# EAGLE design MiataPopUpEnhancer (EAGLE 9.6.0)
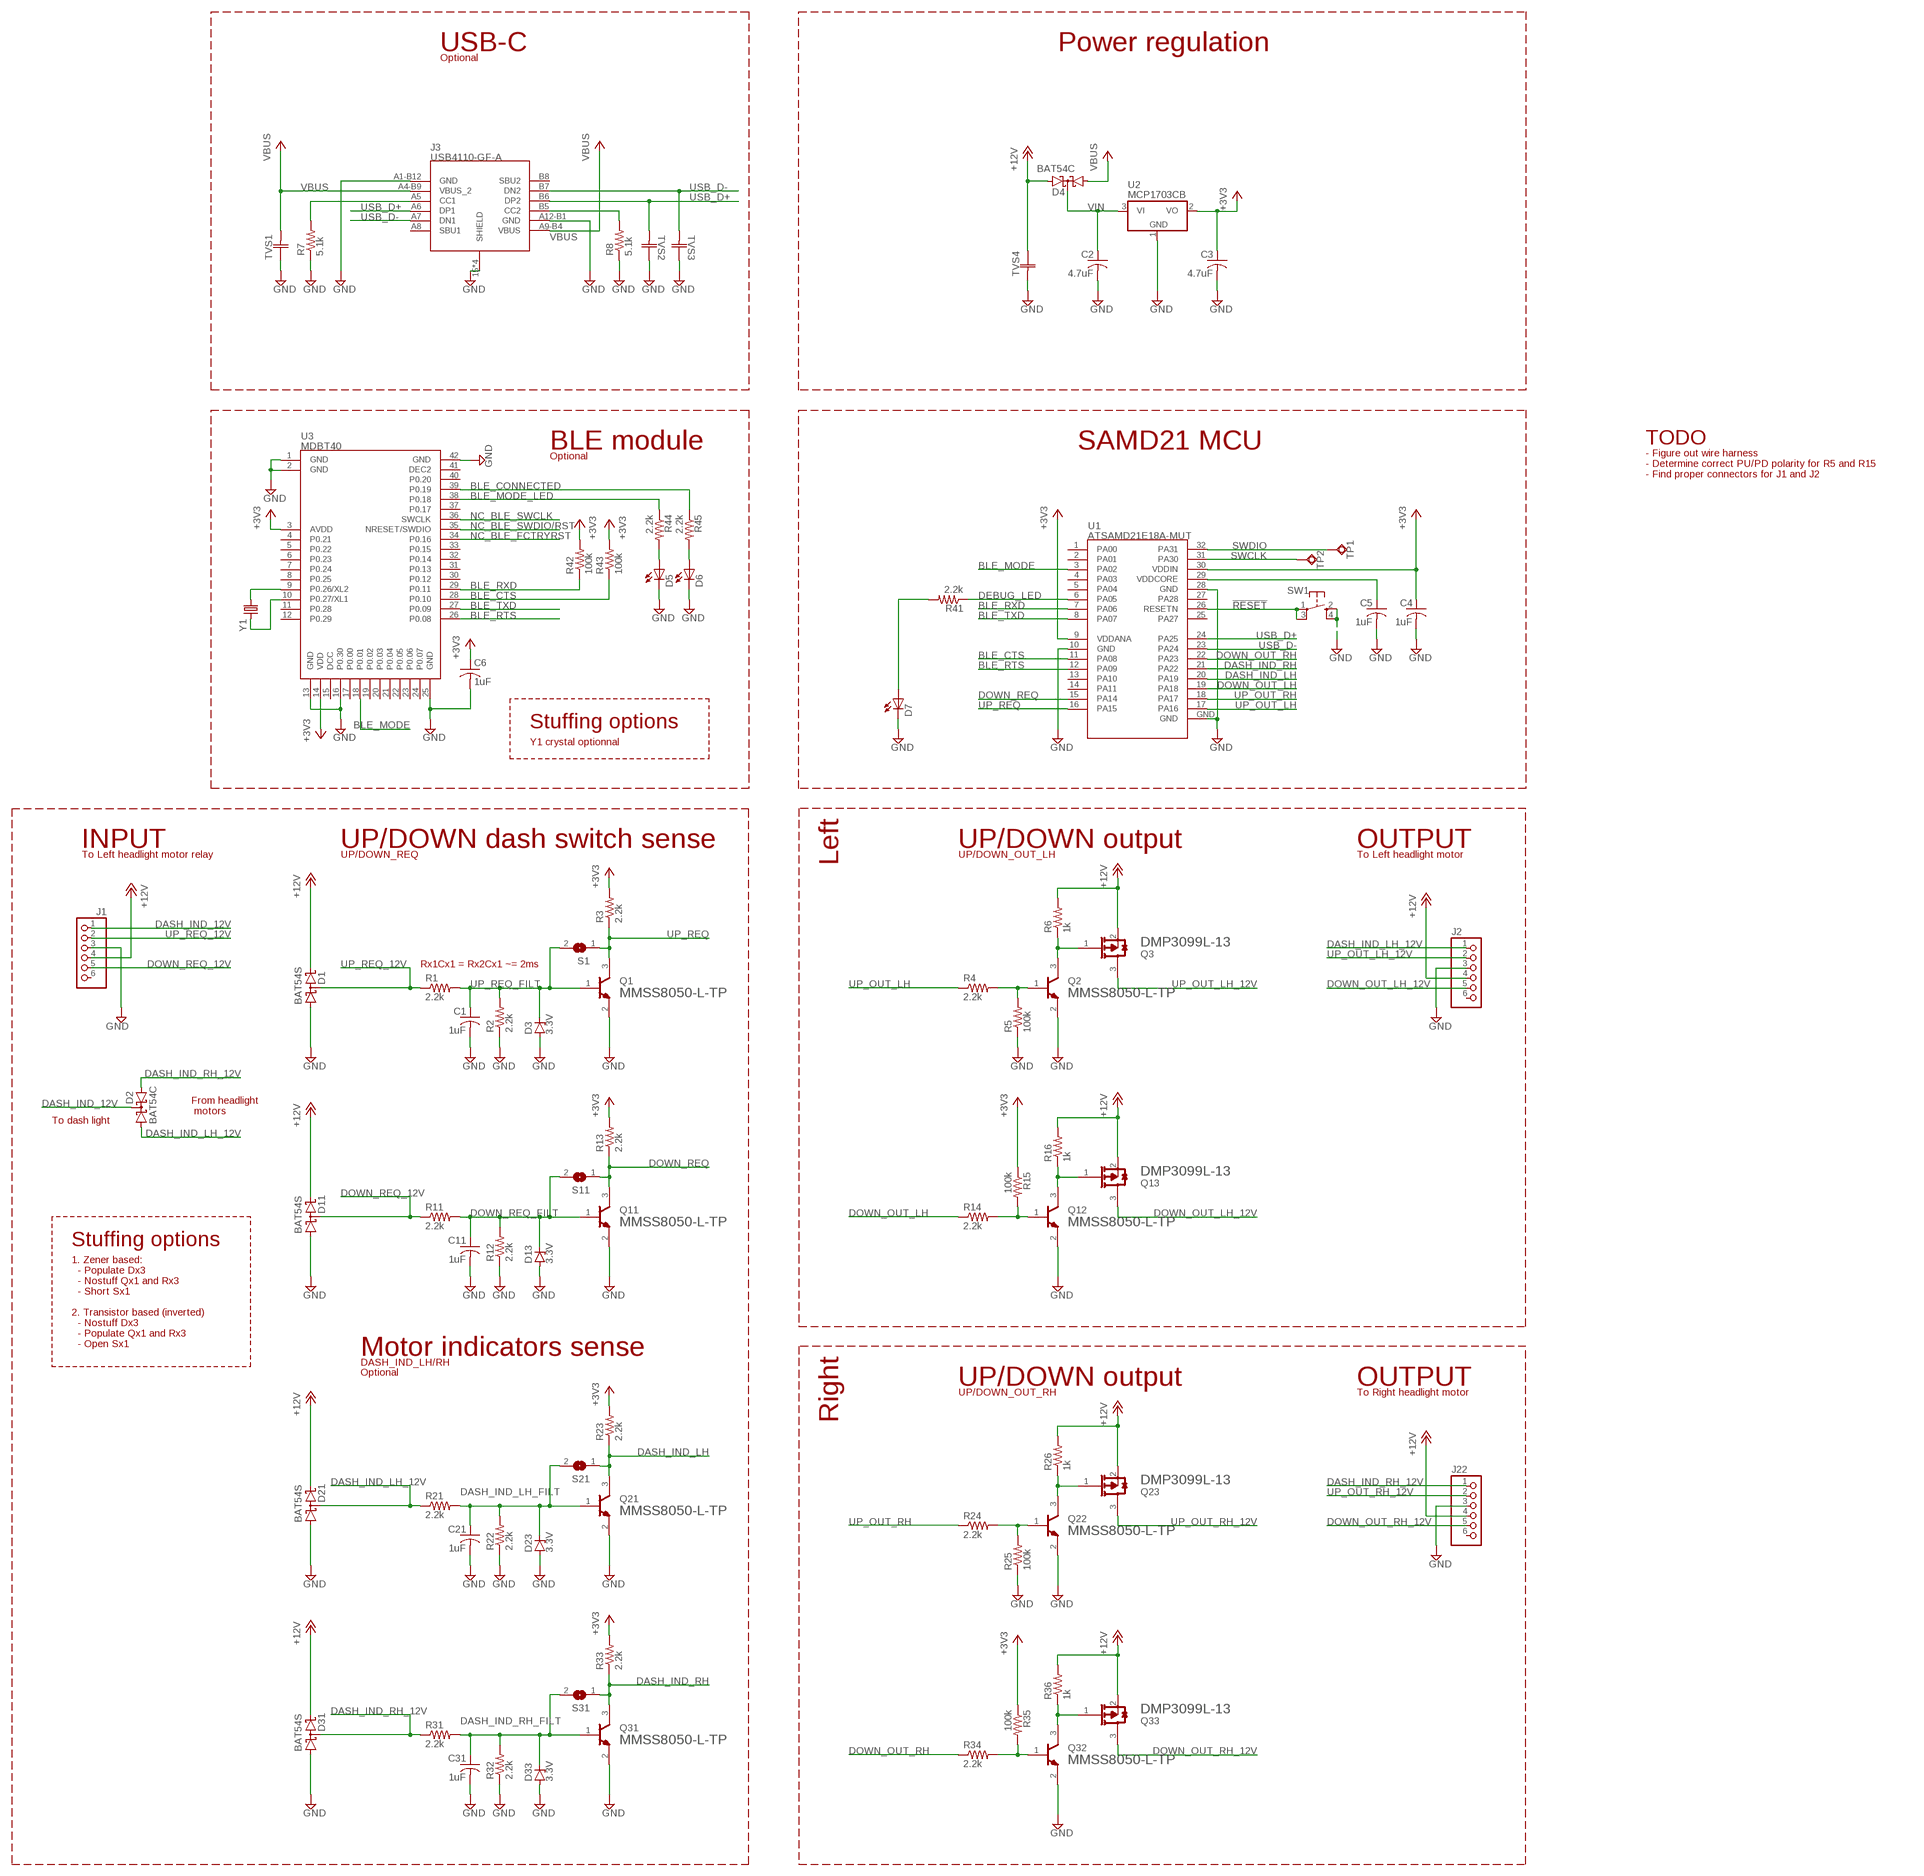
[diagram p0: schematic, sheet 1]

## Parts
C1  1uF  C-USC0603  [C0603]
C2  4.7uF  C-USC0603K  [C0603K]
C3  4.7uF  C-USC0603  [C0603]
C4  1uF  C-USC0603  [C0603]
C5  1uF  C-USC0603  [C0603]
C6  1uF  C-USC0603  [C0603]
C11  1uF  C-USC0603  [C0603]
C21  1uF  C-USC0603  [C0603]
C31  1uF  C-USC0603  [C0603]
D1  BAT54S  [SOT23]
D2  BAT54C  [SOT23]
D3  3.3V  BZX84CSMD  [TO236]
D4  BAT54C  [SOT23]
D5  LEDCHIPLED_0603  [CHIPLED_0603]
D6  LEDCHIPLED_0603  [CHIPLED_0603]
D7  LEDCHIPLED_0603  [CHIPLED_0603]
D11  BAT54S  [SOT23]
D13  3.3V  BZX84CSMD  [TO236]
D21  BAT54S  [SOT23]
D23  3.3V  BZX84CSMD  [TO236]
D31  BAT54S  [SOT23]
D33  3.3V  BZX84CSMD  [TO236]
J1  PINHD-1X6LOCK  [1X06-BIGLOCK]
J2  PINHD-1X6LOCK  [1X06-BIGLOCK]
J3  USB4110-GF-A  [USB4110-GF-A_GCT]
J22  PINHD-1X6LOCK  [1X06-BIGLOCK]
Q1  MICRO_COMMERCIAL_MMSS8050-L-TPMICRO_COMMERCIAL_MMSS8050-L-TP_0_0  [MICRO_COMMERCIAL_MMSS8050-L-TP_0]
Q2  MICRO_COMMERCIAL_MMSS8050-L-TPMICRO_COMMERCIAL_MMSS8050-L-TP_0_0  [MICRO_COMMERCIAL_MMSS8050-L-TP_0]
Q3  DIODES_INC_DMP3099L-13DIODES_INC_DMP3099L-13_0_0  [DIODES_INC_DMP3099L-13_0]
Q11  MICRO_COMMERCIAL_MMSS8050-L-TPMICRO_COMMERCIAL_MMSS8050-L-TP_0_0  [MICRO_COMMERCIAL_MMSS8050-L-TP_0]
Q12  MICRO_COMMERCIAL_MMSS8050-L-TPMICRO_COMMERCIAL_MMSS8050-L-TP_0_0  [MICRO_COMMERCIAL_MMSS8050-L-TP_0]
Q13  DIODES_INC_DMP3099L-13DIODES_INC_DMP3099L-13_0_0  [DIODES_INC_DMP3099L-13_0]
Q21  MICRO_COMMERCIAL_MMSS8050-L-TPMICRO_COMMERCIAL_MMSS8050-L-TP_0_0  [MICRO_COMMERCIAL_MMSS8050-L-TP_0]
Q22  MICRO_COMMERCIAL_MMSS8050-L-TPMICRO_COMMERCIAL_MMSS8050-L-TP_0_0  [MICRO_COMMERCIAL_MMSS8050-L-TP_0]
Q23  DIODES_INC_DMP3099L-13DIODES_INC_DMP3099L-13_0_0  [DIODES_INC_DMP3099L-13_0]
Q31  MICRO_COMMERCIAL_MMSS8050-L-TPMICRO_COMMERCIAL_MMSS8050-L-TP_0_0  [MICRO_COMMERCIAL_MMSS8050-L-TP_0]
Q32  MICRO_COMMERCIAL_MMSS8050-L-TPMICRO_COMMERCIAL_MMSS8050-L-TP_0_0  [MICRO_COMMERCIAL_MMSS8050-L-TP_0]
Q33  DIODES_INC_DMP3099L-13DIODES_INC_DMP3099L-13_0_0  [DIODES_INC_DMP3099L-13_0]
R1  2.2k  R-US_R0603  [R0603]
R2  2.2k  R-US_R0603  [R0603]
R3  2.2k  R-US_R0603  [R0603]
R4  2.2k  R-US_R0603  [R0603]
R5  100k  R-US_R0603  [R0603]
R6  1k  R-US_R0603  [R0603]
R7  5.1k  R-US_R0603  [R0603]
R8  5.1k  R-US_R0603  [R0603]
R11  2.2k  R-US_R0603  [R0603]
R12  2.2k  R-US_R0603  [R0603]
R13  2.2k  R-US_R0603  [R0603]
R14  2.2k  R-US_R0603  [R0603]
R15  100k  R-US_R0603  [R0603]
R16  1k  R-US_R0603  [R0603]
R21  2.2k  R-US_R0603  [R0603]
R22  2.2k  R-US_R0603  [R0603]
R23  2.2k  R-US_R0603  [R0603]
R24  2.2k  R-US_R0603  [R0603]
R25  100k  R-US_R0603  [R0603]
R26  1k  R-US_R0603  [R0603]
R31  2.2k  R-US_R0603  [R0603]
R32  2.2k  R-US_R0603  [R0603]
R33  2.2k  R-US_R0603  [R0603]
R34  2.2k  R-US_R0603  [R0603]
R35  100k  R-US_R0603  [R0603]
R36  1k  R-US_R0603  [R0603]
R41  2.2k  R-US_R0603  [R0603]
R42  100k  R-US_R0603  [R0603]
R43  100k  R-US_R0603  [R0603]
R44  2.2k  R-US_R0603  [R0603]
R45  2.2k  R-US_R0603  [R0603]
S1  SJ  [SJ]
S11  SJ  [SJ]
S21  SJ  [SJ]
S31  SJ  [SJ]
SW1  KMR2  SPST_TACT-KMR2  [KMR2]
TP1  TPSQB2,54  [B2,54]
TP2  TPSQB2,54  [B2,54]
TVS1  ESDU02A5V5R17V  [CAP_ESDU02_STP]
TVS2  ESDU02A5V5R17V  [CAP_ESDU02_STP]
TVS3  ESDU02A5V5R17V  [CAP_ESDU02_STP]
TVS4  ESDU02A5V5R17V  [CAP_ESDU02_STP]
U1  ATSAMD21E18A-MUT  [QFN32]
U2  MCP1703CB  [SOT23]
U3  MDBT40  [MDBT40]
Y1  ABS25-32.768KHZ-T  CRYSTALMM20SS  [MM20SS]

## Nets
!RESET: SW1.1(P) SW1.3(P1) U1.26(RESETN)
+3V3: C3.1 C4.1 C6.1 R3.2 R13.2 R15.1 R23.2 R33.2 R35.1 R42.2 R43.2 U1.9(VDDANA) U1.30(VDDIN) U2.2(VO) U3.3(AVDD) U3.14(VDD)
+12V: D1.2(C2) D4.2(A2) D11.2(C2) D21.2(C2) D31.2(C2) J1.4 J2.4 J22.4 Q3.2(S) Q13.2(S) Q23.2(S) Q33.2(S) R6.2 R16.2 R26.2 R36.2 TVS4.1
BLE_CONNECTED: R45.1 U3.39(P0.19)
BLE_CTS: R43.1 U1.11(PA08) U3.28(P0.10)
BLE_MODE: U1.3(PA02) U3.18(P0.01)
BLE_MODE_LED: R44.1 U3.38(P0.18)
BLE_RTS: U1.12(PA09) U3.26(P0.08)
BLE_RXD: R42.1 U1.7(PA06) U3.29(P0.11)
BLE_TXD: U1.8(PA07) U3.27(P0.09)
CC1: J3.A5(CC1) R7.2
CC2: J3.B5(CC2) R8.2
DASH_IND_12V: D2.3(CC) J1.1
DASH_IND_LH: Q21.3(C) R23.1 S21.1 U1.20(PA19)
DASH_IND_LH_12V: D2.1(A1) D21.3(C1A2) J2.1 R21.1
DASH_IND_LH_FILT: C21.1 D23.C Q21.1(B) R21.2 R22.2 S21.2
DASH_IND_RH: Q31.3(C) R33.1 S31.1 U1.21(PA22)
DASH_IND_RH_12V: D2.2(A2) D31.3(C1A2) J22.1 R31.1
DASH_IND_RH_FILT: C31.1 D33.C Q31.1(B) R31.2 R32.2 S31.2
DEBUG_LED: R41.1 U1.6(PA05)
DOWN_OUT_LH: R14.1 U1.19(PA18)
DOWN_OUT_LH_12V: J2.5 Q13.3(D)
DOWN_OUT_RH: R34.1 U1.22(PA23)
DOWN_OUT_RH_12V: J22.5 Q33.3(D)
DOWN_REQ: Q11.3(C) R13.1 S11.1 U1.15(PA14)
DOWN_REQ_12V: D11.3(C1A2) J1.5 R11.1
DOWN_REQ_FILT: C11.1 D13.C Q11.1(B) R11.2 R12.2 S11.2
GND: C1.2 C2.2 C3.2 C4.2 C5.2 C6.2 C11.2 C21.2 C31.2 D1.1(A1) D3.A D5.C D6.C D7.C D11.1(A1) D13.A D21.1(A1) D23.A D31.1(A1) D33.A J1.3 J2.3 J3.15(SHIELD) J3.16(SHIELD) J3.17(SHIELD) J3.18(SHIELD) J3.A1-B12(GND) J3.A12-B1(GND) J22.3 Q1.2(E) Q2.2(E) Q11.2(E) Q12.2(E) Q21.2(E) Q22.2(E) Q31.2(E) Q32.2(E) R2.1 R5.1 R7.1 R8.1 R12.1 R22.1 R25.1 R32.1 SW1.2(S) SW1.4(S1) TVS1.1 TVS2.1 TVS3.1 TVS4.2 U1.10(GND) U1.28(GND) U1.GND U2.1(GND) U3.1(GND) U3.2(GND) U3.13(GND) U3.16(P0.30) U3.25(GND) U3.42(GND)
N$1: Q12.3(C) Q13.1(G) R16.1
N$2: Q2.3(C) Q3.1(G) R6.1
N$4: Q12.1(B) R14.2 R15.2
N$5: Q2.1(B) R4.2 R5.2
N$7: Q22.3(C) Q23.1(G) R26.1
N$8: Q22.1(B) R24.2 R25.2
N$10: Q32.3(C) Q33.1(G) R36.1
N$11: Q32.1(B) R34.2 R35.2
N$14: D5.A R44.2
N$15: D6.A R45.2
N$16: D7.A R41.2
NC_BLE_FCTRYRST: U3.34(P0.16)
NC_BLE_SWCLK: U3.36(SWCLK)
NC_BLE_SWDIO/RST: U3.35(NRESET/SWDIO)
SWCLK: TP2.TP U1.31(PA30)
SWDIO: TP1.TP U1.32(PA31)
UP_OUT_LH: R4.1 U1.17(PA16)
UP_OUT_LH_12V: J2.2 Q3.3(D)
UP_OUT_RH: R24.1 U1.18(PA17)
UP_OUT_RH_12V: J22.2 Q23.3(D)
UP_REQ: Q1.3(C) R3.1 S1.1 U1.16(PA15)
UP_REQ_12V: D1.3(C1A2) J1.2 R1.1
UP_REQ_FILT: C1.1 D3.C Q1.1(B) R1.2 R2.2 S1.2
USB_D+: J3.A6(DP1) J3.B6(DP2) TVS2.2 U1.24(PA25)
USB_D-: J3.A7(DN1) J3.B7(DN2) TVS3.2 U1.23(PA24)
VBUS: D4.1(A1) J3.A4-B9(VBUS_2) J3.A9-B4(VBUS) TVS1.2
VDDCORE: C5.1 U1.29(VDDCORE)
VIN: C2.1 D4.3(CC) U2.3(VI)
XL1: U3.10(P0.27/XL1) Y1.4
XL2: U3.9(P0.26/XL2) Y1.1
Unconnected: J1.6 J2.6 J3.A8(SBU1) J3.B8(SBU2) J22.6 U1.1(PA00) U1.2(PA01) U1.4(PA03) U1.5(PA04) U1.13(PA10) U1.14(PA11) U1.25(PA27) U1.27(PA28) U3.4(P0.21) U3.5(P0.22) U3.6(P0.23) U3.7(P0.24) U3.8(P0.25) U3.11(P0.28) U3.12(P0.29) U3.15(DCC) U3.17(P0.00) U3.19(P0.02) U3.20(P0.03) U3.21(P0.04) U3.22(P0.05) U3.23(P0.06) U3.24(P0.07) U3.30(P0.12) U3.31(P0.13) U3.32(P0.14) U3.33(P0.15) U3.37(P0.17) U3.40(P0.20) U3.41(DEC2)

## Notes on the sheet
- USB-C | Power regulation
- Optional
- TODO
- BLE module | SAMD21 MCU
- - Figure out wire harness
  - Determine correct PU/PD polarity for R5 and R15
  - Find proper connectors for J1 and J2
- Optional
- Stuffing options
- Y1 crystal optionnal
- Left
- INPUT | UP/DOWN dash switch sense | UP/DOWN output | OUTPUT
- To Left headlight motor relay | UP/DOWN_REQ | UP/DOWN_OUT_LH | To Left headlight motor
- Rx1Cx1 = Rx2Cx1 ~= 2ms
- From headlight
   motors
- To dash light
- Stuffing options
- 1. Zener based:
    - Populate Dx3
    - Nostuff Qx1 and Rx3
    - Short Sx1
  
  2. Transistor based (inverted)
    - Nostuff Dx3
    - Populate Qx1 and Rx3
    - Open Sx1
- Motor indicators sense | Right
- DASH_IND_LH/RH
- Optional
- UP/DOWN output | OUTPUT
- UP/DOWN_OUT_RH | To Right headlight motor

## Library data of the parts
C1-C6 C11 C21 C31 = adafruit:C-US: CAPACITOR, American symbol
D1 D11 D21 D31 = diode:BAT54S: Schottky Diodes Pin connection corrected 2011-05-04 Source: Fairchild .. BAT54.pdf
D2 D4 = diode:BAT54C: Schottky Diodes Source: Fairchild .. BAT54.pdf
D3 D13 D23 D33 = diode:BZX84CSMD: Z DIODE
D5-D7 = adafruit:LED: LED OSRAM: - CHIPLED LG R971, LG N971, LY N971, LG Q971, LY Q971, LO R971, LY R971 LH N974, LH R974 LS Q976, LO Q976, LY Q976 LO Q996 - Hyper CHIPLED LW Q18S LB Q993, LB Q99A, LB R99A - SideLED LS A670, LO A670, LY A670, LG A670, LP A670 LB A673, LV A673, LT A673, LW A673 LH A674 LY A675 LS A676, LA A676, LO A676, LY A676, LW A676 LS A679, LY A679, LG A679 - Hyper Micro SIDELED® LS Y876, LA Y876, LO Y876, LY Y876 LT Y87S - SmartLED LW L88C, LW L88S LB L89C, LB L89S, LG L890 LS L89K, LO L89K, LY L89K LS L896, LA L896, LO L896, LY L896 - TOPLED LS T670, LO T670, LY T670, LG T670, LP T670 LSG T670, LSP T670, LSY T670, LOP T670, LYG T670 LG T671, LOG T671, LSG T671 LB T673, LV T673, LT T673, LW T673 LH T674 LS T676, LA T676, LO T676, LY T676, LB T676, LH T676, LSB T676, LW T676 LB T67C, LV T67C, LT T67C, LS T67K, LO T67K, LY T67K, LW E67C LS E67B, LA E67B, LO E67B, LY E67B, LB E67C, LV E67C, LT E67C LW T67C LS T679, LY T679, LG T679 LS T770, LO T770, LY T770, LG T770, LP T770 LB T773, LV T773, LT T773, LW T773 LH T774 LS E675, LA E675, LY E675, LS T675 LS T776, LA T776, LO T776, LY T776, LB T776 LHGB T686 LT T68C, LB T68C - Hyper Mini TOPLED® LB M676 - Mini TOPLED Santana® LG M470 LS M47K, LO M47K, LY M47K Source: http://www.osram.convergy.de/
J1 J2 J22 = adafruit:PINHD-1X6: PIN HEADER
J3 = USB4110-GF-A:USB4110-GF-A; COPYRIGHT: Copyright (C) 2021 Ultra Librarian. All rights reserved.; DIGI-KEY_PART_NUMBER_1: 2073-USB4110-GF-A-1-ND; DIGI-KEY_PART_NUMBER_2: 2073-USB4110-GF-A-2-ND; DIGI-KEY_PART_NUMBER_3: 2073-USB4110-GF-A-6-ND; MANUFACTURER_PART_NUMBER: USB4110-GF-A; MFR_NAME: Global Connector Technology
Q1 Q2 Q11 Q12 Q21 Q22 Q31 Q32 = Micro Commercial - MMSS8050-L-TP - Copy:MICRO_COMMERCIAL_MMSS8050-L-TP: MMSS8050-L-TP; CENTROID_NOT_SPECIFIED: No; DATASHEET: http://www.mccsemi.com/up_pdf/MMSS8050(SOT-23).pdf; DIGIKEY_DESCRIPTION: TRANS Bipolar (BJT) Transistor NPN 25V 1.5A 100MHz 625mW Surface Mount SOT-23; DIGIKEY_PART_NUMBER: MMSS8050-L-TPMSCT-ND; IPC_LAND_PATTERN_NAME: SOT96P237X100-3; LEAD_FREE: yes; MF: Micro Commercial; MOUSER_PART_NUMBER: 833-MMSS8050-L-TP; MPN: MMSS8050-L-TP; PACKAGE: SOT23-3; PREFIX: Q; ROHS: yes; TEMPERATURE_RANGE_HIGH: +150°C; TEMPERATURE_RANGE_LOW: -55°C
Q3 Q13 Q23 Q33 = Diodes Inc. - DMP3099L-13:DIODES_INC_DMP3099L-13: P-Channel 30V 3.8A (Ta) 1.08W (Ta) Surface Mount SOT-23; AUTOMOTIVE: Yes; AUTOMOTIVE_GRADE: Grade 0; CENTROID_NOT_SPECIFIED: No; CONTINUOUS_DRAIN_CURRENT: -3.8A; DATASHEET: https://www.diodes.com/assets/Datasheets/DMP3099L.pdf; DEPLETION_MODE: False; DEVICE_CLASS_L1: Discrete Semiconductors; DEVICE_CLASS_L2: Transistors; DEVICE_CLASS_L3: MOSFETs; DIGIKEY_DESCRIPTION: MOSFET P-CH 30V 3.8A SOT23; DIGIKEY_PART_NUMBER: DMP3099L-13DICT-ND; DRAIN_TO_SOURCE_BREAKDOWN_VOLTAGE: -30V; DRAIN_TO_SOURCE_RESISTANCE: 65mΩ; DRAIN_TO_SOURCE_VOLTAGE: -30V; FOOTPRINT_PARAMETERS_1: {"fp_type":"SOT23","params":{"N":{"default":"3","long name":"Number of leads","type":"multichoice","short name":"N"},"A":{"nom":1024999,"long name":"Height","min":903000,"max":1100000,"short name":"A","type":"measurement"},"A1":{"nom":50000,"long name":"Package clearance","min":13000,"max":100000,"short name":"A1","type":"measurement"},"A2":{"nom":975000,"long name":"Package height","min":890000,"max":1000000,"short name":"A2","type":"measurement"},"D":{"nom":2900000,"long name":"Package length","min":2800000,"max":3000000,"short name":"D","type":"measurement"},"E":{"nom":2400000,"long name":"Width /w leads","min":2300000,"max":2500000,"short name":"E","type":"measurement"},"E1":{"nom":1300000,"long name":"Package width","min":1200000,"max":1400000,"short name":"E1","type":"measurement"},"B":{"nom":400000,"long name":"Lead width","min":370000,"max":510000,"short name":"B","type":"measurement"},"C":{"nom":110000,"long name":"Lead thickness","min":85000,"max":150000,"short name":"C","type":"measurement"},"L":{"nom":400000,"long name":"Lead foot length","min":250000,"max":550000,"short name":"L","type":"measurement"},"e":{"nom":915000,"long name":"Lead pitch","min":null,"max":null,"short name":"e","type":"measurement"},"PHI":{"nom":false,"long name":"Lead angle","min":0,"max":8,"short name":"PHI","type":"measurement"},"offset x":{"nom":0,"long name":"X Center offset","min":null,"max":null,"short name":"offset x","type":"measurement"},"offset y":{"nom":0,"long name":"Y Center offset","min":null,"max":null,"short name":"offset y","type":"measurement"},"LS":{"default":"Rounded rectangle","long name":"Land shape","type":"multichoice","short name":"LS"},"LS1":{"default":"Rectangle","long name":"Land shape (Pin 1)","type":"multichoice","short name":"LS1"},"solder toe":{"nom":550000,"long name":"Solder fillet (toe)","min":null,"max":null,"short name":"solder toe","type":"fixedmeasurement"},"solder heel":{"nom":450000,"long name":"Solder fillet (heel)","min":null,"max":null,"short name":"solder heel","type":"fixedmeasurement"},"solder side":{"nom":50000,"long name":"Solder fillet (side)","min":null,"max":null,"short name":"solder side","type":"fixedmeasurement"},"courtyard":{"nom":500000,"long name":"Courtyard","min":null,"max":null,"short name":"courtyard","type":"fixedmeasurement"},"SF":{"default":"A","long name":"Packing level","type":"multichoiceparent","short name":"SF","help":"http://support.upverter.com/customer/portal/articles/978783-what-is-a-footprint-packing-level","children":["solder toe","solder heel","solder side","courtyard"]}}}; FOOTPRINT_PARAMETERS_2: {"fp_type":"SOT23","params":{"N":{"default":"3","long name":"Number of leads","type":"multichoice","short name":"N"},"A":{"nom":1024999,"long name":"Height","min":903000,"max":1100000,"short name":"A","type":"measurement"},"A1":{"nom":50000,"long name":"Package clearance","min":13000,"max":100000,"short name":"A1","type":"measurement"},"A2":{"nom":975000,"long name":"Package height","min":890000,"max":1000000,"short name":"A2","type":"measurement"},"D":{"nom":2900000,"long name":"Package length","min":2800000,"max":3000000,"short name":"D","type":"measurement"},"E":{"nom":2400000,"long name":"Width /w leads","min":2300000,"max":2500000,"short name":"E","type":"measurement"},"E1":{"nom":1300000,"long name":"Package width","min":1200000,"max":1400000,"short name":"E1","type":"measurement"},"B":{"nom":400000,"long name":"Lead width","min":370000,"max":510000,"short name":"B","type":"measurement"},"C":{"nom":110000,"long name":"Lead thickness","min":85000,"max":150000,"short name":"C","type":"measurement"},"L":{"nom":400000,"long name":"Lead foot length","min":250000,"max":550000,"short name":"L","type":"measurement"},"e":{"nom":915000,"long name":"Lead pitch","min":null,"max":null,"short name":"e","type":"measurement"},"PHI":{"nom":false,"long name":"Lead angle","min":0,"max":8,"short name":"PHI","type":"measurement"},"offset x":{"nom":0,"long name":"X Center offset","min":null,"max":null,"short name":"offset x","type":"measurement"},"offset y":{"nom":0,"long name":"Y Center offset","min":null,"max":null,"short name":"offset y","type":"measurement"},"LS":{"default":"Rounded rectangle","long name":"Land shape","type":"multichoice","short name":"LS"},"LS1":{"default":"Rectangle","long name":"Land shape (Pin 1)","type":"multichoice","short name":"LS1"},"solder toe":{"nom":350000,"long name":"Solder fillet (toe)","min":null,"max":null,"short name":"solder toe","type":"fixedmeasurement"},"solder heel":{"nom":350000,"long name":"Solder fillet (heel)","min":null,"max":null,"short name":"solder heel","type":"fixedmeasurement"},"solder side":{"nom":30000,"long name":"Solder fillet (side)","min":null,"max":null,"short name":"solder side","type":"fixedmeasurement"},"courtyard":{"nom":250000,"long name":"Courtyard","min":null,"max":null,"short name":"courtyard","type":"fixedmeasurement"},"SF":{"default":"B","long name":"Packing level","type":"multichoiceparent","short name":"SF","help":"http://support.upverter.com/customer/portal/articles/978783-what-is-a-footprint-packing-level","children":["solder toe","solder heel","solder side","courtyard"]}}}; FOOTPRINT_PARAMETERS_3: {"fp_type":"SOT23","params":{"N":{"default":"3","long name":"Number of leads","type":"multichoice","short name":"N"},"A":{"nom":1024999,"long name":"Height","min":903000,"max":1100000,"short name":"A","type":"measurement"},"A1":{"nom":50000,"long name":"Package clearance","min":13000,"max":100000,"short name":"A1","type":"measurement"},"A2":{"nom":975000,"long name":"Package height","min":890000,"max":1000000,"short name":"A2","type":"measurement"},"D":{"nom":2900000,"long name":"Package length","min":2800000,"max":3000000,"short name":"D","type":"measurement"},"E":{"nom":2400000,"long name":"Width /w leads","min":2300000,"max":2500000,"short name":"E","type":"measurement"},"E1":{"nom":1300000,"long name":"Package width","min":1200000,"max":1400000,"short name":"E1","type":"measurement"},"B":{"nom":400000,"long name":"Lead width","min":370000,"max":510000,"short name":"B","type":"measurement"},"C":{"nom":110000,"long name":"Lead thickness","min":85000,"max":150000,"short name":"C","type":"measurement"},"L":{"nom":400000,"long name":"Lead foot length","min":250000,"max":550000,"short name":"L","type":"measurement"},"e":{"nom":915000,"long name":"Lead pitch","min":null,"max":null,"short name":"e","type":"measurement"},"PHI":{"nom":false,"long name":"Lead angle","min":0,"max":8,"short name":"PHI","type":"measurement"},"offset x":{"nom":0,"long name":"X Center offset","min":null,"max":null,"short name":"offset x","type":"measurement"},"offset y":{"nom":0,"long name":"Y Center offset","min":null,"max":null,"short name":"offset y","type":"measurement"},"LS":{"default":"Rounded rectangle","long name":"Land shape","type":"multichoice","short name":"LS"},"LS1":{"default":"Rectangle","long name":"Land shape (Pin 1)","type":"multichoice","short name":"LS1"},"solder toe":{"nom":150000,"long name":"Solder fillet (toe)","min":null,"max":null,"short name":"solder toe","type":"fixedmeasurement"},"solder heel":{"nom":250000,"long name":"Solder fillet (heel)","min":null,"max":null,"short name":"solder heel","type":"fixedmeasurement"},"solder side":{"nom":10000,"long name":"Solder fillet (side)","min":null,"max":null,"short name":"solder side","type":"fixedmeasurement"},"courtyard":{"nom":100000,"long name":"Courtyard","min":null,"max":null,"short name":"courtyard","type":"fixedmeasurement"},"SF":{"default":"C","long name":"Packing level","type":"multichoiceparent","short name":"SF","help":"http://support.upverter.com/customer/portal/articles/978783-what-is-a-footprint-packing-level","children":["solder toe","solder heel","solder side","courtyard"]}}}; FOOTPRINT_URL: https://www.diodes.com/assets/Package-Files/SOT23.pdf; FOOTPRINT_VARIANT_NAME_0: Recommended_Land_Pattern; FOOTPRINT_VARIANT_NAME_1: IPC_A; FOOTPRINT_VARIANT_NAME_2: IPC_B; FOOTPRINT_VARIANT_NAME_3: IPC_C; GATE_CHARGE_AT_VGS: 11nC @ -10V; GATE_TO_SOURCE_VOLTAGE: 20V; HEIGHT: 1.1mm; INPUT_CAPACITACE_AT_VDS: 563pF @ -25V; LEAD_FREE: Yes; MAX_FORWARD_DIODE_VOLTAGE: -1.26V; MAX_JUNCTION_TEMP: +150°C; MF: Diodes Inc.; MFG_PACKAGE_IDENT: SOT23; MFG_PACKAGE_IDENT_COMPONENT_ID: 395c052727f488cf; MFG_PACKAGE_IDENT_DATE: 01/2017; MFG_PACKAGE_IDENT_REV: 0; MOUSER_DESCRIPTION: MOSFET P-Ch ENH FET -30V 65mOhm -10V -3.8A; MOUSER_PART_NUMBER: 621-DMP3099L-13; MPN: DMP3099L-13; NUMBER_OF_CHANNELS: 1; NUMBER_OF_P_CHANNELS: 1; PACKAGE: SOT23; POWER_DISSIPATION: 1.08W; PREFIX: Q; PULSE_DRAIN_CURRENT: -11A; ROHS: Yes; RTHJA_MAX: 115°C/W; STANDOFF_HEIGHT: 0.013mm; TEMPERATURE_RANGE_HIGH: +150°C; TEMPERATURE_RANGE_LOW: -55°C; THRESHOLD_VGS_MAX: -2.1V; THRESHOLD_VGS_MIN: -1V; TURN_OFF_DELAY_TIME: 31ns; TURN_ON_DELAY_TIME: 4.8ns; VERIFICATION_VERSION: 0.0.0.3
R1-R8 R11-R16 R21-R26 R31-R36 R41-R45 = rcl:R-US_: RESISTOR, American symbol; SPICEPREFIX: R
S1 S11 S21 S31 = jumper:SJ: SMD solder JUMPER
SW1 = adafruit:SPST_TACT: SMT 6mm switch, EVQQ2 series http://www.ladyada.net/library/eagle
TP1 TP2 = testpad:TPSQ: Test pad
TVS1-TVS4 = ESDU02A5V5R17V:ESDU02A5V5R17V; COPYRIGHT: Copyright (C) 2021 Ultra Librarian. All rights reserved.; DIGI-KEY_PART_NUMBER_1: ESDU02A5V5R17VCT-ND; DIGI-KEY_PART_NUMBER_2: ESDU02A5V5R17VDKR-ND; DIGI-KEY_PART_NUMBER_3: ESDU02A5V5R17VTR-ND; MANUFACTURER_PART_NUMBER: ESDU02A5V5R17V; MFR_NAME: Stackpole International
U1 = atmel-samd21:ATSAMD21E18A-MUT: This is the ATMEL SAMD21E QFN-32. ATSAMD21E18A
U2 = linear:MCP1703: 250 mA, 16V, Low Quiescent Current LDO Regulator Source: http://ww1.microchip.com/downloads/en/DeviceDoc/22049b.pdf
U3 = MDBT40_210701:MDBT40: Raytac Corporation Part Number: (RAM:16kB) MDBT40-256V3 / MDBT40-P256V3 (RAM:32kB) MDBT40-256RV3 / MDBT40-P256RV3 Bluetooth Low Energy Module based on Noridc nRF51822 Size: 18x10mm Source: Raytac datasheet
Y1 = adafruit:CRYSTAL: CRYSTAL; OC_FARNELL: unknown; OC_NEWARK: unknown

## Board
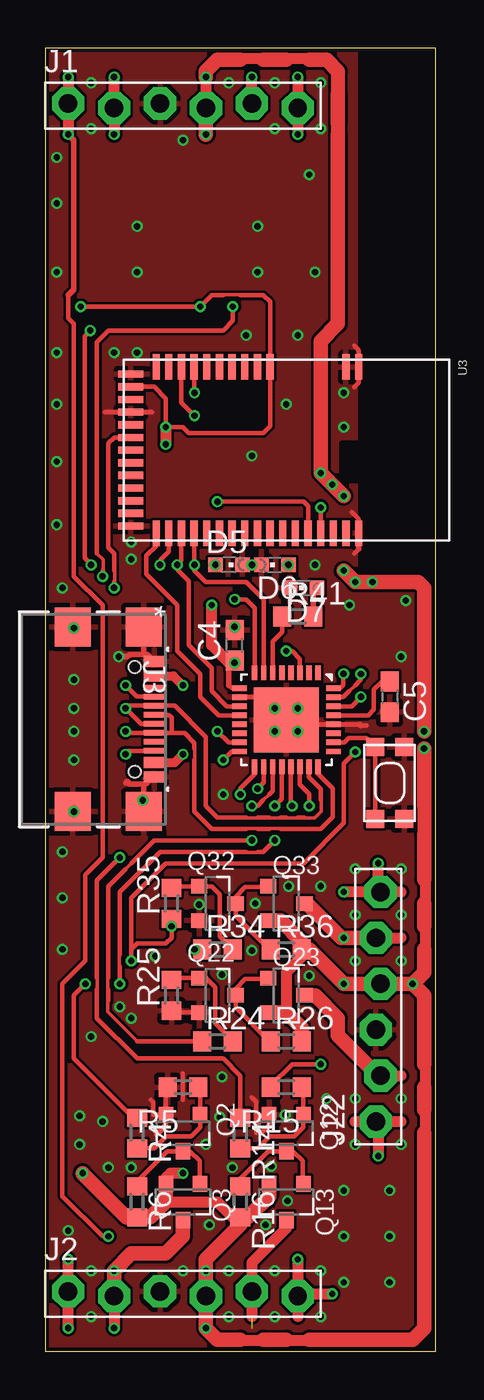
[diagram p1: board, top side]
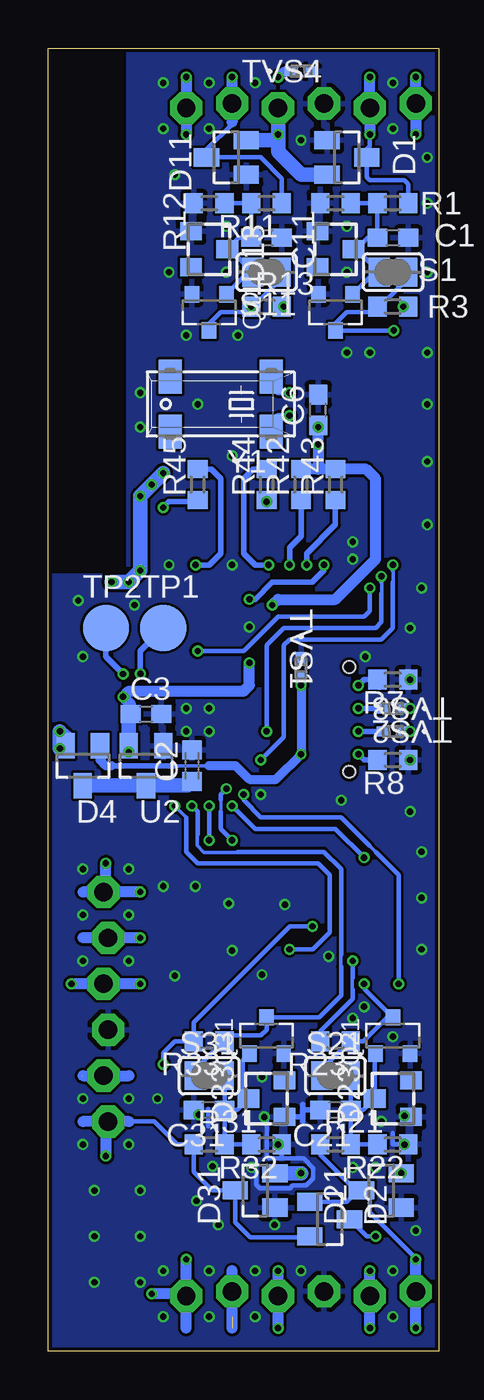
[diagram p2: board, bottom side, seen from below]

Size 21.59 x 72.07 mm. Coordinates in mm from the lower left corner, seen from the top.
Outline: 0,0 21.59,0 21.59,72.07 0,72.07 0,0
Copper layers (1*16): Top 0.035559375mm / dielectric 1.6mm / Bottom 0.035559375mm
Design rules "jlcpcb2layer": minimum track width 5mil, minimum drill 8mil, track to track 5mil, track to pad 8mil, pad to pad 5mil, via to via 10mil, smd to smd 5mil, copper to edge 8mil, drill to drill 20mil, minimum pad ring 12mil, minimum via ring 5mil, stop-mask expansion 2.5mil, vias tented up to drill 20mil, thermal gap 10mil
tRestrict: area 17.5,43.2 to 21.6,72.1
bRestrict: area 17.5,43.2 to 21.6,72.1

### Footprints (pad centres in the part's own frame; a part is rotated, then mirrored left to right if it is on the bottom)
C0603 = smd 1.1 x 1: 1 -0.85,0; 2 0.85,0
C0603K = smd 1.05 x 1.08: 1 -0.875,0; 2 0.875,0
SOT23 = smd 1 x 1.4: 1 -0.95,-1.1; 2 0.95,-1.1; 3 0,1.1
TO236 = smd 1 x 1.2: A -1,-1; C 0,1; NC 1,-1
CHIPLED_0603 = smd 0.8 x 0.8: A 0,-0.75; C 0,0.75
1X06-BIGLOCK = drill 1.016 pad 1.778 octagon: 1 -6.35,0.127; 2 -3.81,-0.127; 3 -1.27,0.127; 4 1.27,-0.127; 5 3.81,0.127; 6 6.35,-0.127
USB4110-GF-A_GCT = smd 2.159 x 2.007: 15 -5.11,2.788; 16 5.11,2.788; 17 -5.11,-1.142; 18 5.11,-1.142 | smd 0.61 x 1.143: A1-B12 -3.2,3.363; A4-B9 -2.4,3.363; A9-B4 2.4,3.363; A12-B1 3.2,3.363 | smd 0.305 x 1.143: A5 -1.25,3.363; A6 -0.25,3.363; A7 0.25,3.363; A8 1.25,3.363; B5 1.75,3.363; B6 0.75,3.363; B7 -0.75,3.363; B8 -1.75,3.363 | hole 0.66: -2.896,2.286; 2.896,2.286
MICRO_COMMERCIAL_MMSS8050-L-TP_0 = smd 0.9 x 0.8: 1 -1,0.95; 2 -1,-0.95; 3 1,0
DIODES_INC_DMP3099L-13_0 = smd 0.9 x 0.8: 1 -1,0.95; 2 -1,-0.95; 3 1,0
R0603 = smd 1 x 1.1: 1 -0.85,0; 2 0.85,0
SJ = smd 1.168 x 1.6: 1 -0.762,0; 2 0.762,0
KMR2 = smd 1 x 1: 1 2,0.8; 2 2,-0.8; 3 -2,0.8; 4 -2,-0.8
B2,54 = smd 2.54 x 2.54: TP 0,0
CAP_ESDU02_STP = smd 0.711 x 0.559: 1 -0.546,0; 2 0.546,0
QFN32 = smd 0.8 x 0.3: 1 -2.6,1.75; 2 -2.6,1.25; 3 -2.6,0.75; 4 -2.6,0.25; 5 -2.6,-0.25; 6 -2.6,-0.75; 7 -2.6,-1.25; 8 -2.6,-1.75; 17 2.6,-1.75; 18 2.6,-1.25; 19 2.6,-0.75; 20 2.6,-0.25; 21 2.6,0.25; 22 2.6,0.75; 23 2.6,1.25; 24 2.6,1.75 | smd 0.3 x 0.8: 9 -1.75,-2.6; 10 -1.25,-2.6; 11 -0.75,-2.6; 12 -0.25,-2.6; 13 0.25,-2.6; 14 0.75,-2.6; 15 1.25,-2.6; 16 1.75,-2.6; 25 1.75,2.6; 26 1.25,2.6; 27 0.75,2.6; 28 0.25,2.6; 29 -0.25,2.6; 30 -0.75,2.6; 31 -1.25,2.6; 32 -1.75,2.6 | smd 3.6 x 3.6: GND 0,0
MDBT40 = smd 1.4 x 0.4: 1 -4.6,4; 2 -4.6,3.3; 3 -4.6,-0.9; 4 -4.6,-1.6; 5 -4.6,-2.3; 6 -4.6,-3; 7 -4.6,-3.7; 8 -4.6,-4.4; 9 -4.6,-5.1; 10 -4.6,-5.8; 11 -4.6,-6.5; 12 -4.6,-7.2; 26 4.6,-7.2; 27 4.6,-6.5; 28 4.6,-5.8; 29 4.6,-5.1; 30 4.6,-4.4; 31 4.6,-3.7; 32 4.6,-3; 33 4.6,-2.3; 34 4.6,-1.6; 35 4.6,-0.9; 36 4.6,-0.2; 37 4.6,0.5; 38 4.6,1.2; 39 4.6,1.9; 40 4.6,2.6; 41 4.6,3.3; 42 4.6,4 | smd 0.4 x 1.4: 13 -4.2,-8.6; 14 -3.5,-8.6; 15 -2.8,-8.6; 16 -2.1,-8.6; 17 -1.4,-8.6; 18 -0.7,-8.6; 19 0,-8.6; 20 0.7,-8.6; 21 1.4,-8.6; 22 2.1,-8.6; 23 2.8,-8.6; 24 3.5,-8.6; 25 4.2,-8.6
MM20SS = smd 1.27 x 1.88: 1 -2.794,-1.524; 2 2.794,-1.524; 3 2.794,1.524; 4 -2.794,1.524

### Placement (x,y rotation side)
C1  2.54,61.59 0 bottom
C2  13.65,32.38 90 bottom
C3  16.19,35.24 0 bottom
C4  10.48,39.05 90 top
C5  19.05,36.2 270 top
C6  6.67,52.07 90 bottom
C11  9.53,61.59 0 bottom
C21  5.71,13.34 180 bottom
C31  12.7,13.34 180 bottom
D1  5.08,66.04 270 bottom
D2  6.03,7.3 270 bottom
D3  5.71,60.96 270 bottom
D4  19.68,32.38 180 bottom
D5  10.16,43.5 270 top
D6  12.7,43.5 90 top
D7  14.29,42.23 90 top
D11  11.75,66.04 90 bottom
D13  12.7,60.96 270 bottom
D21  3.17,8.89 90 bottom
D23  2.54,13.97 90 bottom
D31  10.16,8.89 90 bottom
D33  9.53,13.97 90 bottom
J1  7.62,68.9 0 top
J2  7.62,3.17 0 top
J3  2.67,34.95 270 top
J22  18.41,19.05 90 top
Q1  5.71,57.47 270 bottom
Q2  7.62,12.06 270 top
Q3  7.62,8.26 270 top
Q11  12.7,57.47 270 bottom
Q12  13.34,12.06 270 top
Q13  13.34,8.26 270 top
Q21  2.54,17.46 90 bottom
Q22  9.53,19.68 0 top
Q23  13.34,19.68 0 top
Q31  9.53,17.46 90 bottom
Q32  9.53,24.77 0 top
Q33  13.34,24.77 0 top
R1  2.54,63.5 180 bottom
R2  5.71,63.5 0 bottom
R3  2.54,57.78 0 bottom
R4  5.08,12.06 270 top
R5  7.62,14.61 0 top
R6  5.08,8.26 270 top
R7  2.54,37.15 180 bottom
R8  2.54,32.7 180 bottom
R11  9.53,63.5 180 bottom
R12  12.7,63.5 0 bottom
R13  9.53,57.78 0 bottom
R14  10.79,12.06 270 top
R15  13.34,14.61 0 top
R16  10.79,8.26 270 top
R21  5.71,11.43 0 bottom
R22  2.54,11.43 180 bottom
R23  5.71,17.14 180 bottom
R24  9.53,17.14 0 top
R25  6.99,19.68 90 top
R26  13.34,17.14 0 top
R31  12.7,11.43 0 bottom
R32  9.53,11.43 180 bottom
R33  12.7,17.14 180 bottom
R34  9.53,22.23 0 top
R35  6.99,24.77 90 top
R36  13.34,22.23 0 top
R41  13.97,40.64 0 top
R42  7.62,47.94 90 bottom
R43  5.71,47.94 90 bottom
R44  9.53,47.94 90 bottom
R45  13.34,47.94 90 bottom
S1  2.54,59.69 180 bottom
S11  9.53,59.69 180 bottom
S21  5.71,15.24 0 bottom
S31  12.7,15.24 0 bottom
SW1  19.05,31.43 90 top
TP1  15.24,40.01 0 bottom
TP2  18.41,40.01 0 bottom
TVS1  7.62,37.78 270 bottom
TVS2  2.54,34.29 180 bottom
TVS3  2.54,35.56 180 bottom
TVS4  7.62,70.8 0 bottom
U1  13.34,34.92 270 top
U2  16.19,32.38 180 bottom
U3  13.34,49.85 270 top
Y1  12.06,52.39 180 bottom

### Tracks (layer width: path | path; a pad name or v marks a point on that pad's centre or on a via)
!RESET
  Top 0.254: SW1.3 SW1.1 17.76,33.93 16.78,33.93 16.53,33.67 U1.26
+3V3  (via drill 0.35)
  Top 0.203: 9.84,58.42 9.84,58.44 10.79,58.44 10.79,58.42
  Top 0.254: U1.30 16.94,35.67 v17.46,36.2 | U3.14 6.03,53.35 6.67,52.7 v6.67,51.12 7.62,51.12 7.94,50.8 12.06,50.8 12.44,51.17 U3.3 12.44,58.05 12.06,58.42 10.79,58.42 | R15.1 12.48,14.71 13.65,15.88 v15.24,15.88 | R35.1 v6.99,23.5 6.99,22.86 6.67,22.54 5.08,22.54 4.76,22.23 v4.76,21.59 4.76,25.08 6.67,26.99 14.29,26.99 16.51,29.21 16.51,32.51 v17.14,33.15 | 10.16,36.83 10.31,36.67 U1.9 | v1.97,57.78 v8.57,57.78 9.21,58.42 9.84,58.42 | C4.1 v10.48,38.08
  Top 0.305: v10.48,38.08 10.16,37.76 10.16,36.83
  Top 0.61: v6.67,51.12 v6.67,50.16 | v10.48,38.08 10.18,38.08 9.21,39.05 v9.21,41.27
  Bottom 0.203: 4.76,20.64 4.76,20.61 4.79,20.59 4.79,20.05 4.76,20.02 4.76,20
  Bottom 0.254: v15.24,15.88 15.24,16.51 14.61,17.14 R33.2 13.55,18.2 8.26,23.5 v6.99,23.5 | R13.2 v8.57,57.78 | R23.2 6.57,17.69 4.76,19.49 4.76,20 | v4.76,21.59 4.76,20.64 | U2.2 | v1.97,57.78 R3.2
  Bottom 0.305: R43.2 5.71,48.9 | R42.2 7.62,48.9 | U2.2 v17.14,33.15
  Bottom 0.61: R43.2 4.03,48.79 3.49,48.26 3.49,43.81 5.71,41.59 8.89,41.59 v9.21,41.27 | R43.2 R42.2 | C6.1 v6.67,50.16 6.67,48.79 R43.2 | C3.1 17.04,35.77 v17.46,36.2 17.14,36.51 10.79,36.51 10.48,36.83 v10.48,38.08
  Bottom 0.813: U2.2 17.14,35.14 | 17.14,35.14 C3.1 | 17.14,35.15 17.14,35.14 | C6.1 v6.67,51.12
+12V  (via drill 0.35)
  Top 0.305: 13.34,18.73 Q23.2 | Q3.2 6.67,8.26
  Top 0.61: v8.89,1.27 8.89,3.17 | v7.62,9.84 6.94,9.84 6.67,9.57 Q3.2 | 6.67,8.26 9.53,8.26 10.38,7.41 R16.2 | R36.2 14.19,21.8 13.34,20.95 13.34,18.73 | 12.06,0.64 12,0.57 10.86,0.57 10.79,0.64 | 13.34,0.64 13.4,0.57 14.54,0.57 14.61,0.64 | 20.95,12.06 21.02,12.13 21.02,13.27 20.95,13.34 | 20.95,14.61 21.02,14.67 21.02,15.81 20.95,15.88 | v8.89,70.48 J1.4 | 10.79,71.44 10.86,71.5 12,71.5 12.06,71.44 | 13.34,71.44 13.4,71.5 14.54,71.5 14.61,71.44 | 20.95,24.77 21.02,24.83 21.02,26.04 20.95,26.1 | 20.95,23.5 21.02,23.43 21.02,22.29 20.95,22.23
  Top 0.762: 16.19,70.8 16.19,69.53 | 16.19,67.94 16.19,67.31 | 20.95,30.16 20.95,28.57
  Top 0.813: R26.2 14.19,17.88 13.33,18.73 Q23.2 | Q33.2 13.02,23.82 14.19,22.64 R36.2 14.61,22.23 v16.51,20.32 J22.4 v20.32,20.32 | Q13.2 12.38,8.57 11.21,7.41 R16.2 10.79,6.99 8.89,5.08 v8.89,4.45 8.89,3.17 J2.4 v8.89,1.27 9.53,0.64 10.79,0.64 | 12.06,0.64 13.34,0.64 | 14.61,0.64 20.32,0.64 20.95,1.27 20.95,12.06 | v20.32,20.32 20.95,19.68 20.95,15.88 | 20.95,13.34 20.95,14.61 | v2.08,9.84 2.08,9.8 4.47,7.41 R6.2 5.82,7.41 6.67,8.26 Q3.2 | J1.4 v8.89,67.31 | v8.89,70.48 8.89,70.8 9.53,71.44 10.79,71.44 | 12.06,71.44 13.34,71.44 | 14.61,71.44 15.56,71.44 16.19,70.8 | 16.19,69.53 16.19,67.94 | 16.19,67.31 16.19,56.83 15.24,55.88 v15.24,48.58 v15.88,47.94 v16.51,47.31 | v20.32,20.32 20.95,20.95 20.95,22.23 | v20.95,34.29 20.95,42.23 20.64,42.55 v18.1,42.55 v17.14,42.55 v16.51,43.18 | v20.95,33.34 20.95,30.16 | 20.95,28.57 20.95,26.1 | 20.95,23.5 20.95,24.77
  Bottom 0.508: TVS4.1 8.57,70.8 v8.89,70.48
  Bottom 0.61: v8.89,1.27 v8.89,4.45 | v16.51,20.32 v20.32,20.32
  Bottom 0.813: D31.2 v7.62,9.84 | J1.4 v8.89,67.31 8.89,66.99 | 8.89,66.99 8.89,66.36 7.62,65.09 D1.2 | D11.2 8.89,66.99 | v15.24,48.58 v15.88,47.94 v16.51,47.31 v16.51,43.18 v17.14,42.55 v18.1,42.55 | D4.2 20.64,33.97 v20.95,34.29 v20.95,33.34
BLE_CONNECTED  (via drill 0.35)
  Top 0.254: U3.39 v15.23,46.67
  Top 0.305: v15.24,46.67 v15.23,46.67
  Bottom 0.305: v15.24,46.67 14.92,46.99 13.44,46.99 R45.1
BLE_CTS  (via drill 0.35)
  Top 0.254: U3.28 7.54,43.73 v7.3,43.5 7.3,43.24 7.94,42.61 7.94,39.05 9.21,37.78 9.21,36.51 10.04,35.67 U1.11
  Bottom 0.305: v7.3,43.5 7.3,44.13 5.71,45.72 R43.1
BLE_MODE  (via drill 0.35)
  Top 0.203: 3.81,42.57 3.83,42.59 3.83,43.13 3.81,43.16 3.81,43.18
  Top 0.254: U1.3 14.09,38.3 13.65,38.73 v13.34,38.73 | U3.18 3.81,50.55 3.49,50.23 3.49,44.45 3.81,44.13 3.81,43.18 | v3.81,42.23 3.81,42.57
  Bottom 0.254: v13.34,38.73 10.79,38.73 8.89,40.64 4.13,40.64 3.81,40.96 v3.81,42.23
BLE_MODE_LED  (via drill 0.35)
  Top 0.254: U3.38 14.54,46.74 14.29,46.99 v9.53,46.99
  Bottom 0.305: R44.1 v9.53,46.99
BLE_RTS
  Top 0.254: U1.12 9.59,35.17 8.57,36.2 8.57,37.47 7.3,38.73 7.3,41.27 5.59,42.99 5.59,44.01 6.13,44.55 U3.26
BLE_RXD  (via drill 0.35)
  Top 0.254: 8.26,45.23 v8.26,43.5 8.26,43.18 8.89,42.55 11.11,42.55 12.09,41.57 U1.7
  Top 0.305: U3.29 8.26,45.23
  Bottom 0.305: v8.26,43.5 8.26,44.45 7.62,45.09 R42.1
BLE_TXD  (via drill 0.35)
  Top 0.254: U3.27 6.83,44.24 6.35,43.75 v6.35,43.5 | v10.48,41.59 11.11,41.59 11.59,41.12 U1.8
  Bottom 0.305: v6.35,43.5 6.35,43.18 6.99,42.55 9.21,42.55 10.16,41.59 v10.48,41.59
CC1  (via drill 0.35)
  Top 0.254: J3.A5 5.07,36.2 v4.45,36.83
  Bottom 0.305: R7.2 4.13,37.15 v4.45,36.83
CC2  (via drill 0.35)
  Top 0.254: v4.45,33.02 4.63,33.2 J3.B5
  Bottom 0.305: R8.2 4.13,32.7 v4.45,33.02
DASH_IND_12V  (via drill 0.35)
  Top 0.254: v3.49,6.35 3.17,6.35 0.95,8.57 0.95,20.32 2.22,21.59 2.22,26.35 3.17,27.3 3.17,41.27 1.59,42.86 1.59,56.83 1.27,57.15 1.27,58.42
  Top 0.305: v1.27,67.31 1.59,66.99 1.59,58.74 1.27,58.42
  Top 0.61: v1.27,70.48 J1.1 v1.27,67.31
  Bottom 0.254: D2.3 3.98,6.35 v3.49,6.35
  Bottom 0.61: v1.27,70.48 J1.1 v1.27,67.31
DASH_IND_LH  (via drill 0.35)
  Top 0.203: 11.11,27.62 11.13,27.62 11.16,27.6 11.7,27.6 11.72,27.62 11.75,27.62 | 4.13,21.91 4.13,21.89 4.11,21.86 4.11,21.32 4.13,21.3 4.13,21.27
  Top 0.254: U1.20 13.09,30.55 v12.7,30.16 | 4.13,21.91 4.13,25.4 6.35,27.62 11.11,27.62 | 11.75,27.62 12.06,27.62 v12.7,28.26 | 4.13,21.27 v4.13,20.32
  Bottom 0.254: S21.1 6.48,15.6 4.93,17.14 R23.1 4.17,17.14 2.85,18.46 Q21.3 4.13,20.05 v4.13,20.32 | v12.7,30.16 v12.7,28.26
DASH_IND_LH_12V  (via drill 0.35)
  Top 0.61: v1.27,1.27 v1.27,5.08
  Bottom 0.254: D2.1 5.08,8.26 4.45,8.89 | R21.1 6.57,10.86 4.59,8.89 D21.3 3.81,8.43 3.81,7.68 1.27,5.14 v1.27,5.08
  Bottom 0.305: D2.1 | 4.45,8.89 D21.3 | J2.1 v1.27,5.08
  Bottom 0.61: v1.27,1.27 v1.27,5.08
DASH_IND_LH_FILT
  Bottom 0.254: Q21.1 3.54,16.41 D23.C 4.17,13.34 C21.1 | C21.1 4.87,15.15 S21.2 | C21.1 R21.2 R22.2
DASH_IND_RH  (via drill 0.35)
  Top 0.254: v13.65,30.16 13.59,30.23 U1.21
  Bottom 0.203: 11.11,27.62 11.13,27.62 11.16,27.6 12.99,27.6 13.36,27.96 13.36,28.53 13.34,28.55 13.34,28.57 | 5.4,21.91 5.4,21.89 5.42,21.86 5.42,21.32 5.4,21.3 5.4,21.27
  Bottom 0.254: S31.1 13.46,15.6 11.91,17.14 R33.1 11.53,17.46 9.84,17.46 9.53,17.78 Q31.3 6.62,18.46 5.4,19.68 5.4,21.27 | 11.11,27.62 6.35,27.62 5.4,26.67 5.4,21.91 | 13.34,28.57 13.34,29.84 v13.65,30.16
DASH_IND_RH_12V  (via drill 0.35)
  Top 0.61: 17.14,12.7 18.41,12.7 | 18.41,12.7 19.68,12.7 | 18.41,12.7 v18.41,10.79
  Bottom 0.254: D2.2 7.2,6.29 10.42,6.29 11.26,7.13 D31.3 12.53,8.89 13.55,9.91 R31.1 14.48,11.43 15.75,12.7 17.14,12.7
  Bottom 0.305: 17.14,12.7 J22.1
  Bottom 0.61: 17.14,12.7 18.41,12.7 | 18.41,12.7 19.68,12.7 | 18.41,12.7 v18.41,10.79
DASH_IND_RH_FILT
  Bottom 0.254: R32.2 R31.2 C31.1 | C31.1 11.16,13.34 D33.C 10.84,14.29 10.84,16.09 Q31.1 | C31.1 11.85,15.15
  Bottom 0.305: 11.85,15.15 S31.2
DEBUG_LED
  Top 0.254: U1.6 12.59,39.26 13.12,39.79 R41.1
DOWN_OUT_LH  (via drill 0.35)
  Top 0.203: 12.06,30.48 12.38,30.8 | 2.86,20.64 2.86,20.61 2.88,20.59 2.88,20.05 2.86,20.02 2.86,20
  Top 0.254: 12.38,30.8 12.59,31 U1.19 | 12.06,30.48 11.75,30.16 v11.43,30.16 | R14.1 10.79,15.24 9.84,16.19 5.08,16.19 2.86,18.41 2.86,20 | v4.13,27.3 2.86,26.04 2.86,20.64
  Bottom 0.254: v11.43,30.16 10.16,28.89 5.71,28.89 v4.13,27.3
DOWN_OUT_LH_12V  (1 unrouted)
  Top 0.61: Q13.3 13.34,6.79 11.43,4.89 J2.5 11.43,1.91
  Bottom 0.61: 11.43,1.27 11.43,4.45
DOWN_OUT_RH  (via drill 0.35)
  Top 0.254: v14.61,30.16 14.61,30.82 14.09,31.34 U1.22
  Top 0.305: R34.1 v8.26,22.23
  Bottom 0.203: v14.61,30.16 13.97,29.53
  Bottom 0.254: v8.26,22.23 6.96,22.23 6.03,23.16 6.03,26.35 6.67,26.99 13.34,26.99 13.97,27.62 13.97,29.53
DOWN_OUT_RH_12V  (via drill 0.35)
  Top 0.61: 17.46,22.86 19.68,22.86
  Top 0.813: J22.5 17.46,22.86 v16.51,22.86 16.38,22.86 14.48,24.77 Q33.3
  Bottom 0.61: v16.51,22.86 19.68,22.86
DOWN_REQ  (via drill 0.35)
  Top 0.203: 3.17,43.18 3.17,43.2 3.2,43.23 3.2,43.79 2.86,44.13
  Top 0.254: R13.1 10.38,57 9.84,56.47 3.49,56.47 2.86,55.83 2.86,44.13 | U1.15 10.14,33.67 v9.53,34.29 | 3.17,43.18 v3.17,42.86
  Bottom 0.203: 3.17,42.55 3.17,42.52 3.15,42.5 3.15,41.95 3.17,41.93 3.17,41.91
  Bottom 0.254: S11.1 8.76,59.27 10.25,57.78 R13.1 10.69,57.47 12.06,57.47 12.7,56.83 Q11.3 | v9.53,34.29 9.53,39.05 8.57,40.01 3.49,40.01 3.17,40.32 3.17,41.91 | v3.17,42.86 3.17,42.55
  other vias: 10.38,57.78
DOWN_REQ_12V  (via drill 0.35)
  Top 0.61: J1.5 v11.43,70.48
  Bottom 0.254: R11.1 8.68,64.86 9.86,66.04 D11.3 12.85,66.46 11.43,67.88 11.43,68
  Bottom 0.61: v11.43,70.48 J1.5 11.43,68
DOWN_REQ_FILT
  Bottom 0.254: R12.2 R11.2 C11.1 11.06,61.59 D13.C 11.56,60.96 S11.2 10.53,59.69 Q11.1
GND  (via drill 0.35)
  Top 0.254: U1.10 12.09,36.17 | Q22.2 7.08,18.73 | Q2.2 6.67,14.51 | 6.67,13.08 5.97,13.08 5.97,13.78 5.84,13.91 | 11.68,13.02 12.38,13.02 12.38,12.51 12,12.13 | 11.68,13.02 11.68,12.06 | 11.68,13.02 11.68,13.78 11.43,14.03 | 6.67,13.02 6.67,12.51 | 3.3,51.95 U3.16 5.91,51.95 | 17.08,55.63 17.34,55.37 17.34,53.59 17.08,53.34 | 16.95,46.42 17.34,46.04 17.34,44.39 17.08,44.13 | 13.97,34.67 U1.28 17.39,34.67 | 7.62,15.37 7.62,13.91 | 17.46,34.61 17.78,34.61 | U1.GND v13.97,34.29
  Top 0.305: 12.09,36.17 U1.GND | 7.08,18.73 R25.1 | 6.67,14.51 R5.1 | 6.67,12.51 6.16,12 | 17.34,44.39 | U3.42 17.34,44.39 | v4.06,38.42 4.55,38.42 4.67,38.54 5.46,38.54 | J3.A1-B12 5.65,38.54 5.46,38.54 | J3.15 5.46,38.54 | J3.A12-B1 5.94,31.75 5.55,31.37 5.46,31.37 | 5.46,31.37 4.67,31.37 4.53,31.52 4.45,31.43 | J3.16 5.46,31.37 | 13.97,34.67 v13.97,35.56 | 17.39,34.67 17.46,34.61
  Bottom 0.254: 2.54,12.06 2.54,11.43 v1.91,11.43 | 12.76,13.4 12.76,12.45 | v10.35,10.16 10.09,9.9 10.09,9.2 9.9,9.01 8.22,9.01 8.07,9.16 7.34,9.16 6.94,9.56 6.94,10.12 7.48,10.67 8.68,10.67 | 8.68,10.67 9.4,10.67 9.53,10.79 9.53,12.83 v9.65,12.95 | R32.1 8.68,10.67
  Bottom 0.305: 7.53,13.65 7.53,12.7 | 7.62,12.95 8.51,12.95 | 6.6,13.34 7.49,13.34
  other vias: 1.59,34.29 1.59,35.56 1.59,37.15 1.59,32.7 9.84,30.8 19.05,3.81 16.51,3.81 16.51,6.35 19.05,6.35 19.05,8.89 16.51,8.89 3.17,12.7 9.08,6.99 8.89,11.43 9.78,15.18 6.1,21.84 8.51,24.7 13.27,13.08 11.62,24.77 13.46,25.72 15.24,25.72 17.14,21.59 17.14,24.13 17.14,13.97 15.56,13.97 7.62,4.45 2.54,4.45 1.27,6.67 4.76,10.16 12.51,10.22 10.16,4.45 3.49,10.16 4.13,19.05 4.76,18.41 9.78,20.83 14.61,20.76 12.19,6.99 13.4,8.32 0.95,22.23 0.95,25.08 0.95,27.62 19.68,21.59 19.68,24.13 19.68,13.97 12.7,4.45 12.7,1.91 10.16,1.91 2.54,1.91 17.14,26.67 19.68,26.67 17.14,11.43 19.68,11.43 15.24,4.45 15.24,1.91 12.7,35.56 12.7,34.29 11.43,43.5 11.43,22.16 1.91,13.02 2.54,17.4 11.43,49.53 13.34,52.39 5.4,30.48 1.59,29.84 1.59,40.01 16.51,53.02 16.83,41.27 19.68,38.42 19.94,41.53 4.76,44.77 4.76,43.81 3.81,55.24 5.08,55.24 11.11,56.2 5.08,59.69 5.08,62.23 0.95,42.23 0.64,45.72 0.64,49.21 0.64,52.39 0.64,55.24 0.64,59.69 0.64,63.5 0.64,66.04 7.62,66.99 10.16,70.17 12.7,70.17 12.7,67.63 2.54,70.17 2.54,67.63 15.24,70.17 15.24,67.63 14.61,65.09 11.75,62.23 11.75,59.69 13.97,56.2 14.92,59.69 16.51,51.12 14.92,43.5 10.48,40.07
  pour Bottom (isolate 0.152): 0,0 21.59,0 21.59,72.07 0,72.07
  pour Top (isolate 0.152): 0,0 21.59,0 21.59,72.07 0,72.07
N$1
  Top 0.254: 10.79,9.53 12.34,11.06 Q12.3 13.7,11.06 14.25,10.52 14.25,9.29
  Top 0.305: R16.1 10.79,9.53 | Q13.1 14.25,9.29
N$2
  Top 0.254: R6.1 5.08,9.4 6.75,11.06 Q2.3 7.99,11.06 8.54,10.52 8.54,9.29
  Top 0.305: Q3.1 8.54,9.29
N$3  (via drill 0.35)
  Top 0.61: v13.97,5.08 13.97,3.17 | 13.97,3.17 13.97,1.91 | 13.97,3.17 v15.88,3.17
  Bottom 0.61: 13.97,1.27 13.97,3.17 | 13.97,3.17 v13.97,5.08 | 13.97,3.17 v15.88,3.17
N$4
  Top 0.254: 14.29,14.51 Q12.1 14.29,12.38 13.78,11.87 12.41,11.87 11.75,11.21 R14.2
  Top 0.305: 14.29,14.51 R15.2
N$5
  Top 0.254: R4.2 6.03,11.21 6.69,11.87 8.06,11.87 8.57,12.38 Q2.1 8.57,14.51
  Top 0.305: 8.57,14.51 R5.2
N$6  (via drill 0.35)
  Top 0.61: v13.97,70.48 v13.97,67.31
  Bottom 0.61: v13.97,70.48 v13.97,67.31
N$7
  Top 0.254: 12.38,17.14 10.53,19 Q22.3 10.53,20.05 11.07,20.6 12.3,20.6
  Top 0.305: R26.1 12.38,17.14 | Q23.1 12.3,20.6
N$8
  Top 0.254: Q22.1 7.08,20.64 | R24.2 9.4,18.12 9.4,20.13 8.89,20.64
  Top 0.305: 7.08,20.64 R25.2 | 8.89,20.64 Q22.1
N$10
  Top 0.254: 12.38,22.23 10.53,24.08 Q32.3 10.53,25.13 11.07,25.68 12.3,25.68
  Top 0.305: R36.1 12.38,22.23 | Q33.1 12.3,25.68
N$11
  Top 0.254: R35.2 7.08,25.71 Q32.1 9.21,25.71 9.65,25.27 9.65,22.95 R34.2
N$13  (via drill 0.35)
  Top 0.61: 18.41,25.4 v16.51,25.4 | 18.41,25.4 v18.41,26.99 | 19.68,25.4 18.41,25.4
  Bottom 0.61: v16.51,25.4 18.41,25.4 | 18.41,25.4 19.68,25.4 | 18.41,25.4 v18.41,26.99
N$14  (via drill 0.35)
  Bottom 0.305: R44.2 10.26,48.79 10.79,48.26 10.79,44.13 10.16,43.5 D5.A
  other vias: 9.41,43.5
N$15  (via drill 0.35)
  Bottom 0.305: R45.2 12.6,48.79 12.06,48.26 12.06,44.13 12.7,43.5 D6.A
  other vias: 13.45,43.5
N$16
  Top 0.305: D7.A 14.82,42.01 R41.2
SWCLK  (via drill 0.35)
  Top 0.203: 16.83,36.51 17.14,36.83
  Top 0.254: U1.31 16.49,36.17 16.83,36.51 | v17.46,37.47 17.46,37.15 17.14,36.83
  Bottom 0.305: TP2.TP 18.41,38.42 v17.46,37.47
SWDIO  (via drill 0.35)
  Top 0.254: v16.5,37.47 v16.51,37.47 16.5,37.45 16.5,36.84 16.33,36.67 U1.32
  Bottom 0.305: v16.5,37.47 16.5,38.74 TP1.TP
UP_OUT_LH  (via drill 0.35)
  Top 0.254: 4.87,12.91 1.59,16.19 1.59,19.68 v2.22,20.32 | U1.17 11.59,31.92 10.79,31.13 v10.79,30.8
  Top 0.305: R4.1 4.87,12.91
  Bottom 0.203: 3.49,27.62 3.81,27.94
  Bottom 0.254: v10.79,30.8 10.79,30.48 9.84,29.53 5.4,29.53 3.81,27.94 | v2.22,20.32 2.22,26.35 3.49,27.62
UP_OUT_LH_12V  (via drill 0.35)
  Top 0.61: 3.81,3.17 v3.81,1.27
  Top 0.813: J2.2 3.81,3.17 v3.81,4.45 4.76,5.4 6.67,5.4 7.62,6.35 Q3.3
  Bottom 0.61: v3.81,1.27 v3.81,4.45
UP_OUT_RH  (via drill 0.35)
  Top 0.203: 3.49,19.37 3.49,19.34 3.47,19.32 3.47,18.75 5.08,17.14 | 3.49,20.64 3.49,20.61 3.47,20.59 3.47,20.05 3.49,20.02 3.49,20 | 4.45,26.67 4.76,26.99
  Top 0.254: U1.18 12.09,31.47 11.75,31.13 | R24.1 5.08,17.14 | 3.49,20.64 3.49,25.72 4.45,26.67 | 3.49,20 3.49,19.37 | v11.43,28.26 6.03,28.26 4.76,26.99
  Top 0.305: 11.75,31.13 v11.75,31.11
  Bottom 0.152: 12.06,30.48 12.06,29.84
  Bottom 0.203: 12.06,30.46 12.06,30.48
  Bottom 0.254: v11.43,28.26 12.06,28.89 12.06,29.84 | v11.75,31.11 12.06,30.8 12.06,30.48
UP_OUT_RH_12V  (1 unrouted)
  Top 0.61: 18.41,15.24 19.68,15.24
  Top 0.813: J22.2 18.41,15.24 16.19,17.46 16.19,18.41 14.92,19.68 Q23.3
  Bottom 0.61: 19.68,15.24 17.14,15.24
UP_REQ  (via drill 0.35)
  Top 0.254: U1.16 10.31,33.17 v9.84,32.7 | v2.49,56.47 2.17,56.15 2.17,43.86 v2.54,43.5
  Bottom 0.203: 2.54,43.18 2.54,43.16 2.52,43.13 2.52,42.59 2.54,42.57 2.54,42.55
  Bottom 0.254: S1.1 1.78,59.27 3.26,57.78 R3.1 3.71,57.47 5.08,57.47 5.71,56.83 Q1.3 v2.49,56.47 | 2.54,42.55 2.54,40.01 3.17,39.37 8.26,39.37 8.57,39.05 8.57,33.97 v9.84,32.7 | v2.54,43.5 2.54,43.18
UP_REQ_12V  (via drill 0.35)
  Top 0.61: v3.81,70.48 J1.2 v3.81,67.31
  Bottom 0.254: R1.1 1.69,64.56 1.91,64.77 3.81,64.77 3.98,64.94 D1.3 3.98,66.5 3.81,66.67 v3.81,67.31
  Bottom 0.61: v3.81,70.48 J1.2 v3.81,67.31
UP_REQ_FILT
  Bottom 0.254: 4.57,60.96 S1.2 3.54,59.69 Q1.1 | 4.57,60.96 D3.C | 4.57,60.96 3.94,61.59 C1.1 R1.2 R2.2
USB_D+  (via drill 0.35)
  Top 0.203: 11.11,28.89 11.13,28.89 11.16,28.91 11.7,28.91 11.72,28.89 11.75,28.89 | 12.38,28.89 12.4,28.89 12.43,28.91 12.97,28.91 12.99,28.89 13.02,28.89 | 8.26,33.34 8.26,33.31 8.28,33.29 8.28,32.75 8.26,32.73 8.26,32.7
  Top 0.254: 6.99,34.2 6.99,35.05 6.83,35.2 J3.A6 | v4.45,34.29 4.53,34.2 J3.B6 6.99,34.2 | U1.24 15.09,31.95 15.89,31.14 15.89,29.55 15.24,28.89 13.02,28.89 | 11.11,28.89 9.21,28.89 8.26,29.84 8.26,32.7 | 11.75,28.89 12.38,28.89 | 8.26,33.34 8.26,33.66 7.71,34.2 6.99,34.2
  Bottom 0.305: v4.45,34.29 TVS2.2
USB_D-  (via drill 0.35)
  Top 0.203: 11.11,29.53 11.13,29.53 11.16,29.5 11.7,29.5 11.72,29.53 11.75,29.53 | 12.38,29.53 12.4,29.53 12.43,29.5 12.97,29.5 12.99,29.53 13.02,29.53 | 13.34,29.53 13.36,29.53 13.38,29.5 13.93,29.5 13.95,29.53 13.97,29.53 | 14.29,29.53 14.31,29.53 14.33,29.5 14.9,29.5 15.26,29.87 15.26,30.43 15.24,30.46 15.24,30.48
  Top 0.254: J3.A7 5.3,34.7 v4.45,35.56 4.59,35.7 J3.B7 7.16,35.7 8.89,33.97 8.89,30.16 9.53,29.53 11.11,29.53 | U1.23 14.59,31.77 15.24,31.11 15.24,30.48 | 11.75,29.53 12.38,29.53 | 13.02,29.53 13.34,29.53 | 14.29,29.53 13.97,29.53
  Bottom 0.305: v4.45,35.56 TVS3.2
VBUS  (via drill 0.35)
  Top 0.508: J3.A9-B4 7.16,32.55 v7.62,33.02 | J3.A4-B9 7.09,37.35 v7.62,36.83
  Bottom 0.203: 12.7,32.38 14.61,32.38
  Bottom 0.305: 14.61,32.38 18.1,32.38
  Bottom 0.508: TVS1.2 v7.62,36.83 v7.62,33.02 9.01,31.63 10.47,31.63 11.23,32.38 12.7,32.38 | D4.1 18.73,32.7 18.41,32.38 18.1,32.38
VDDCORE
  Top 0.254: U1.29 17.86,35.17 18.18,35.5 18.18,36.6 18.63,37.05 C5.1
VIN
  Bottom 0.813: D4.3 U2.3 13.9,31.29 13.68,31.51 C2.1
XL1  (via drill 0.35)
  Top 0.254: U3.10 7.54,52.47 v8.26,51.75
  Bottom 0.305: Y1.4 9.27,51.37 8.89,51.75 v8.26,51.75
XL2  (via drill 0.35)
  Top 0.254: 8.23,53.04 U3.9
  Top 0.305: v8.26,53.02 8.23,53.04
  Bottom 0.305: Y1.1 9.27,53.4 8.89,53.02 v8.26,53.02